# Altium schematic sheet FPGA2.SchDoc: Animated Archer Main PCB
size Letter; Author: John Eric Martin; Engineer: John Eric Martin; Organization: UCCS IEEE Robotics; Address1: 1420 Austin Bluffs Pkwy; Address2: Colorado Springs, CO 80918; DocumentNumber: FPGA2; Revision: 1; SheetNumber: 4; SheetTotal: 10; ProjectName: Animated Archer Quadcopter
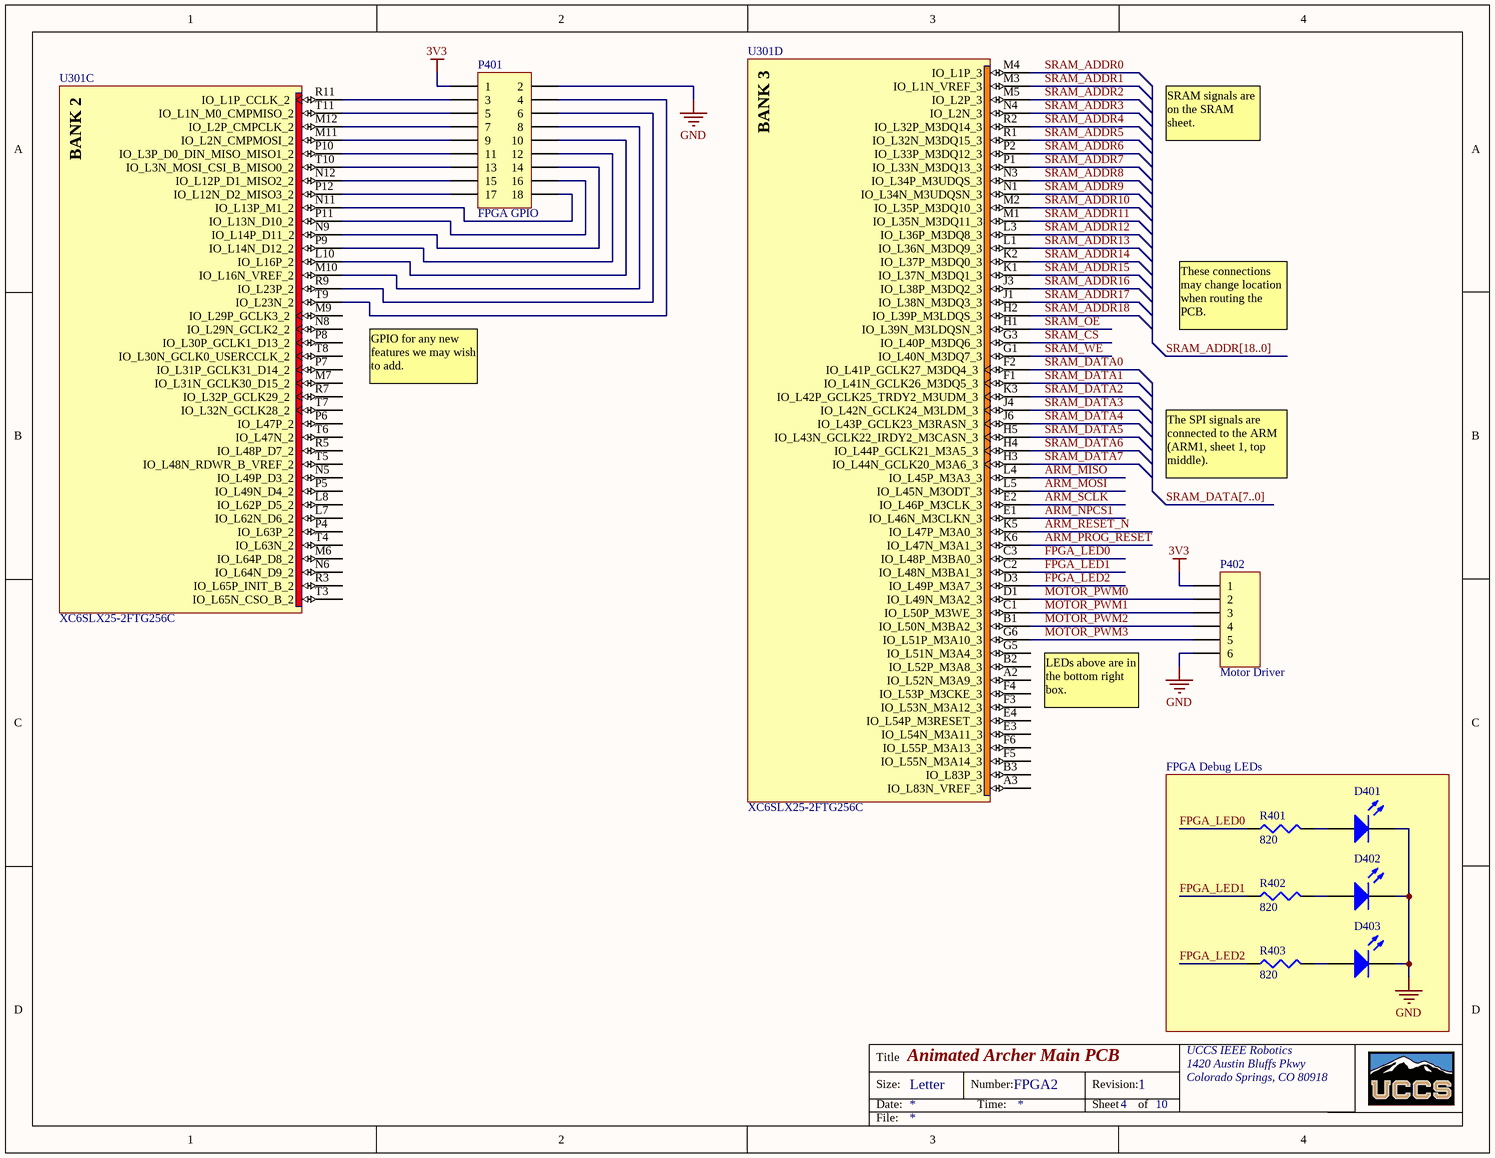
[diagram p0: FPGA2.SchDoc]

## Parts
D401  Green  [1608[0603]]  (value not drawn)
D402  Green  [1608[0603]]  (value not drawn)
D403  Green  [1608[0603]]  (value not drawn)
P401  FPGA GPIO  [HDR2X9]
P402  Motor Driver  [HDR1X6]
R401  value 820  [J1-0603]  (hidden comment: Res3)
R402  value 820  [J1-0603]  (hidden comment: Res3)
R403  value 820  [J1-0603]  (hidden comment: Res3)
U301  XC6SLX25-2FTG256C  [FTG256]  (parts C,D of 7)

## Blocks framed on the sheet
FPGA Debug LEDs: D401-D403 R401-R403

## Nets
3V3: P401.1 P402.1
GND: D401.2(K) D402.2(K) D403.2(K) P401.2 P402.6
ARM_MISO: U301.L4(IO_L45P_M3A3_3)
ARM_MOSI: U301.L5(IO_L45N_M3ODT_3)
ARM_NPCS1: U301.E1(IO_L46N_M3CLKN_3)
ARM_PROG_RESET: U301.K6(IO_L47N_M3A1_3)
ARM_RESET_N: U301.K5(IO_L47P_M3A0_3)
ARM_SCLK: U301.E2(IO_L46P_M3CLK_3)
FPGA_LED0: R401.1 U301.C3(IO_L48P_M3BA0_3)
FPGA_LED1: R402.1 U301.C2(IO_L48N_M3BA1_3)
FPGA_LED2: R403.1 U301.D3(IO_L49P_M3A7_3)
MOTOR_PWM0: P402.2 U301.D1(IO_L49N_M3A2_3)
MOTOR_PWM1: P402.3 U301.C1(IO_L50P_M3WE_3)
MOTOR_PWM2: P402.4 U301.B1(IO_L50N_M3BA2_3)
MOTOR_PWM3: P402.5 U301.G6(IO_L51P_M3A10_3)
SRAM_ADDR0: U301.M4(IO_L1P_3)
SRAM_ADDR1: U301.M3(IO_L1N_VREF_3)
SRAM_ADDR2: U301.M5(IO_L2P_3)
SRAM_ADDR3: U301.N4(IO_L2N_3)
SRAM_ADDR4: U301.R2(IO_L32P_M3DQ14_3)
SRAM_ADDR5: U301.R1(IO_L32N_M3DQ15_3)
SRAM_ADDR6: U301.P2(IO_L33P_M3DQ12_3)
SRAM_ADDR7: U301.P1(IO_L33N_M3DQ13_3)
SRAM_ADDR8: U301.N3(IO_L34P_M3UDQS_3)
SRAM_ADDR9: U301.N1(IO_L34N_M3UDQSN_3)
SRAM_ADDR10: U301.M2(IO_L35P_M3DQ10_3)
SRAM_ADDR11: U301.M1(IO_L35N_M3DQ11_3)
SRAM_ADDR12: U301.L3(IO_L36P_M3DQ8_3)
SRAM_ADDR13: U301.L1(IO_L36N_M3DQ9_3)
SRAM_ADDR14: U301.K2(IO_L37P_M3DQ0_3)
SRAM_ADDR15: U301.K1(IO_L37N_M3DQ1_3)
SRAM_ADDR16: U301.J3(IO_L38P_M3DQ2_3)
SRAM_ADDR17: U301.J1(IO_L38N_M3DQ3_3)
SRAM_ADDR18: U301.H2(IO_L39P_M3LDQS_3)
SRAM_CS: U301.G3(IO_L40P_M3DQ6_3)
SRAM_DATA0: U301.F2(IO_L41P_GCLK27_M3DQ4_3)
SRAM_DATA1: U301.F1(IO_L41N_GCLK26_M3DQ5_3)
SRAM_DATA2: U301.K3(IO_L42P_GCLK25_TRDY2_M3UDM_3)
SRAM_DATA3: U301.J4(IO_L42N_GCLK24_M3LDM_3)
SRAM_DATA4: U301.J6(IO_L43P_GCLK23_M3RASN_3)
SRAM_DATA5: U301.H5(IO_L43N_GCLK22_IRDY2_M3CASN_3)
SRAM_DATA6: U301.H4(IO_L44P_GCLK21_M3A5_3)
SRAM_DATA7: U301.H3(IO_L44N_GCLK20_M3A6_3)
SRAM_OE: U301.H1(IO_L39N_M3LDQSN_3)
SRAM_WE: U301.G1(IO_L40N_M3DQ7_3)
NetD401_1: D401.1(A) R401.2
NetD402_1: D402.1(A) R402.2
NetD403_1: D403.1(A) R403.2
NetP401_3: P401.3 U301.R11(IO_L1P_CCLK_2)
NetP401_4: P401.4 U301.T9(IO_L23N_2)
NetP401_5: P401.5 U301.T11(IO_L1N_M0_CMPMISO_2)
NetP401_6: P401.6 U301.R9(IO_L23P_2)
NetP401_7: P401.7 U301.M12(IO_L2P_CMPCLK_2)
NetP401_8: P401.8 U301.M10(IO_L16N_VREF_2)
NetP401_9: P401.9 U301.M11(IO_L2N_CMPMOSI_2)
NetP401_10: P401.10 U301.L10(IO_L16P_2)
NetP401_11: P401.11 U301.P10(IO_L3P_D0_DIN_MISO_MISO1_2)
NetP401_12: P401.12 U301.P9(IO_L14N_D12_2)
NetP401_13: P401.13 U301.T10(IO_L3N_MOSI_CSI_B_MISO0_2)
NetP401_14: P401.14 U301.N9(IO_L14P_D11_2)
NetP401_15: P401.15 U301.N12(IO_L12P_D1_MISO2_2)
NetP401_16: P401.16 U301.P11(IO_L13N_D10_2)
NetP401_17: P401.17 U301.P12(IO_L12N_D2_MISO3_2)
NetP401_18: P401.18 U301.N11(IO_L13P_M1_2)

Not connected (* = marked no-connect by the designer): U301 A2(IO_L52N_M3A9_3) A3(IO_L83N_VREF_3) B2(IO_L52P_M3A8_3) B3(IO_L83P_3) E3(IO_L54N_M3A11_3) E4(IO_L54P_M3RESET_3) F3(IO_L53N_M3A12_3) F4(IO_L53P_M3CKE_3) F5(IO_L55N_M3A14_3) F6(IO_L55P_M3A13_3) G5(IO_L51N_M3A4_3) L7(IO_L62N_D6_2) L8(IO_L62P_D5_2) M6(IO_L64P_D8_2) M7(IO_L31N_GCLK30_D15_2) M9(IO_L29P_GCLK3_2) N5(IO_L49P_D3_2) N6(IO_L64N_D9_2) N8(IO_L29N_GCLK2_2) P4(IO_L63P_2) P5(IO_L49N_D4_2) P6(IO_L47P_2) P7(IO_L31P_GCLK31_D14_2) P8(IO_L30P_GCLK1_D13_2) R3(IO_L65P_INIT_B_2) R5(IO_L48P_D7_2) R7(IO_L32P_GCLK29_2) T3(IO_L65N_CSO_B_2) T4(IO_L63N_2) T5(IO_L48N_RDWR_B_VREF_2) T6(IO_L47N_2) T7(IO_L32N_GCLK28_2) T8(IO_L30N_GCLK0_USERCCLK_2)

## Buses and harness runs
bus SRAM_ADDR[18..0]
bus SRAM_DATA[7..0]

## Notes on the sheet
- SRAM signals are on the SRAM sheet.
- These connections may change location when routing the PCB.
- GPIO for any new features we may wish to add.
- The SPI signals are connected to the ARM (ARM1, sheet 1, top middle).
- LEDs above are in the bottom right box.
- Title
- Size:
- Date:
- Letter
- Number:
- Time:
- Revision:
- Sheet
- of
- File:
- (in symbol XC6SLX25-2FTG256C, part C) BANK 2
- (in symbol XC6SLX25-2FTG256C, part D) BANK 3

## Library data of the parts
D401-D403 = LED2: Typical RED, GREEN, YELLOW, AMBER GaAs LED; Published: 8-Jun-2000; LatestRevisionDate: 17-Jul-2002; LatestRevisionNote: Re-released for DXP Platform.; PackageVersion: Feb-2002; PackageReference: 3.2X1.6X1.1; Publisher: Altium Limited; PackageDescription: SM LED; 2 Flat Leads
P401 = Header 9X2: Header, 9-Pin, Dual row; LatestRevisionDate: 17-Jul-2002; LatestRevisionNote: Re-released for DXP Platform.; Publisher: Altium Limited
P402 = Header 6: Header, 6-Pin; LatestRevisionDate: 17-Jul-2002; LatestRevisionNote: Re-released for DXP Platform.; Publisher: Altium Limited
R401-R403 = Res3: Resistor; Published: 8-Jun-2000; LatestRevisionDate: 29-May-2009; LatestRevisionNote: IPC-7351 Footprint Added.; PackageReference: J1-0603; Publisher: Altium Limited; PackageDescription: Chip Resistor
U301 = XC6SLX25-2FTG256C: Spartan-6 LX 1.2V FPGA, 186 User I/Os, 256-Ball Fine-Pitch Thin BGA (1.0mm Pitch), Speed Grade 2, Commercial Grade, Pb-Free; Published: 17-Nov-2009; DatasheetVersion: ver1.6, Nov-2010; PackageVersion: ver1.3, Oct-2007; PackageReference: FTG256; Publisher: Altium Limited; PackageDescription: 256-Ball Fine Pitch Thin Ball Grid Array 1.00 mm Pitch (FTG256) - Pb-Free; Supplier 1: Digi-Key; Supplier Part Number 1: XC6SLX25-2FTG256C-ND; Code_JEDEC: MS-034-AAF-1*; ComponentLink1Description: Manufacturer Link; ComponentLink1URL: http://www.xilinx.com; ComponentLink2Description: Spartan-6 Datasheet; ComponentLink2URL: http://www.xilinx.com/support/documentation/data_sheets/ds160.pdf; ComponentLink3Description: Spartan-6 Documents; ComponentLink3URL: http://www.xilinx.com/support/documentation/spartan-6.htm; ComponentLink4Description: Xilinx.com Home; ComponentLink4URL: http://www.xilinx.com